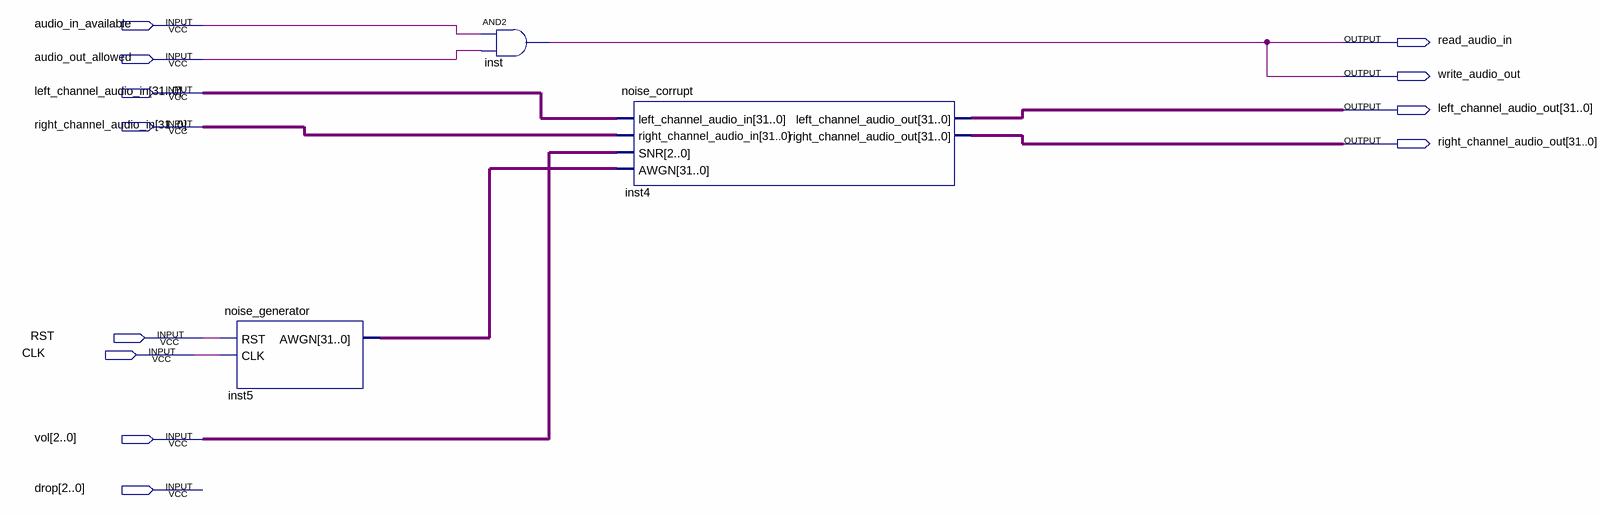
[diagram p0: schematic sheet]
// Quartus schematic AWGN_block.bdf as structural Verilog: 3 symbols, 12 pins
module AWGN_block (
  input  audio_in_available,
  input  audio_out_allowed,
  input  [31:0] left_channel_audio_in,
  input  [31:0] right_channel_audio_in,
  input  RST,
  input  CLK,
  input  [2:0] vol,
  input  [2:0] drop,
  output read_audio_in,
  output write_audio_out,
  output [31:0] left_channel_audio_out,
  output [31:0] right_channel_audio_out
);

  wire [31:0] inst5_awgn;

  noise_generator inst5 (.RST(RST), .CLK(CLK), .AWGN(inst5_awgn));
  and inst (read_audio_in, audio_in_available, audio_out_allowed);
  noise_corrupt inst4 (
    .left_channel_audio_in(left_channel_audio_in), .right_channel_audio_in(right_channel_audio_in),
    .SNR(vol), .AWGN(inst5_awgn), .left_channel_audio_out(left_channel_audio_out),
    .right_channel_audio_out(right_channel_audio_out));

  assign write_audio_out = read_audio_in;
endmodule
